# EAGLE schematic power (EAGLE 8.6.0)

## Sheet 1 of 2
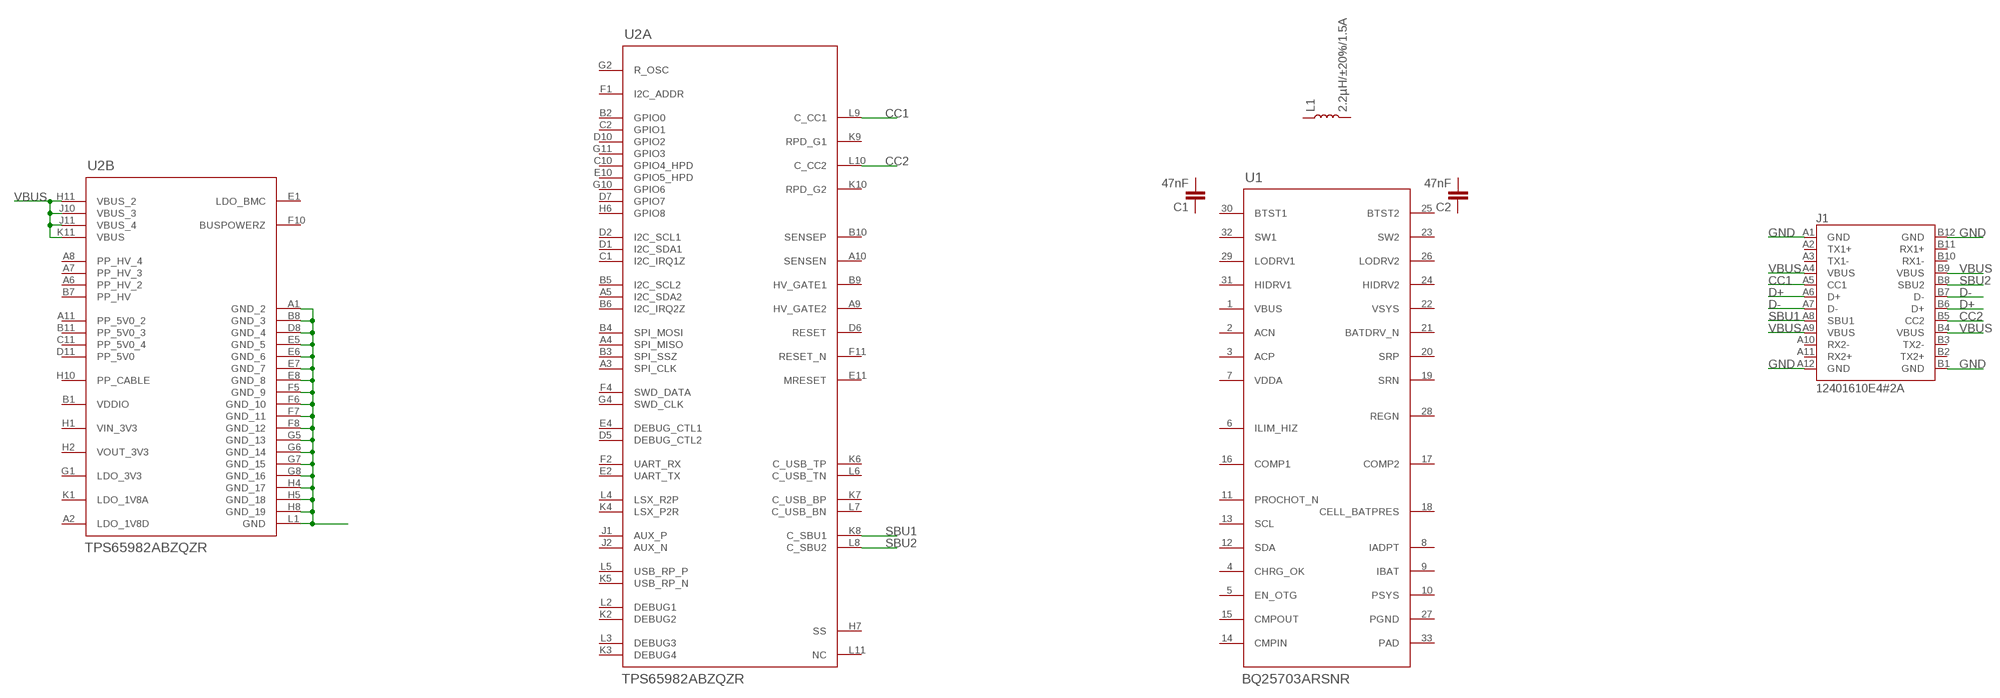
[diagram p0: schematic, sheet 1]

### Parts
C1  47nF  47NF-0603-25V-5%  [0603]
C2  47nF  47NF-0603-25V-5%  [0603]
J1  12401610E4#2A  [AMPHENOL_12401610E4#2A]
L1  2.2µH/±20%/1.5A  INDUCTOR-VLF4012AT-2.2UH  [INDUCTOR_2.2UH]
U1  BQ25703ARSNR  [RSN0032B]
U2  TPS65982ABZQZR  [ZQZ0096A]

### Nets
CC1: J1.A5(CC1) U2.L9(A:C_CC1)
CC2: J1.B5(CC2) U2.L10(A:C_CC2)
D+: J1.A6(D+) J1.B6(D+) ; also sheet 2
D-: J1.A7(D-) J1.B7(D-) ; also sheet 2
GND: J1.A1(GND) J1.A12(GND) J1.B1(GND) J1.B12(GND) U2.A1(B:GND_2) U2.B8(B:GND_3) U2.D8(B:GND_4) U2.E5(B:GND_5) U2.E6(B:GND_6) U2.E7(B:GND_7) U2.E8(B:GND_8) U2.F5(B:GND_9) U2.F6(B:GND_10) U2.F7(B:GND_11) U2.F8(B:GND_12) U2.G5(B:GND_13) U2.G6(B:GND_14) U2.G7(B:GND_15) U2.G8(B:GND_16) U2.H4(B:GND_17) U2.H5(B:GND_18) U2.H8(B:GND_19) U2.L1(B:GND) ; also sheet 2
SBU1: J1.A8(SBU1) U2.K8(A:C_SBU1)
SBU2: J1.B8(SBU2) U2.L8(A:C_SBU2)
VBUS: J1.A4(VBUS) J1.A9(VBUS) J1.B4(VBUS) J1.B9(VBUS) U2.H11(B:VBUS_2) U2.J10(B:VBUS_3) U2.J11(B:VBUS_4) U2.K11(B:VBUS) ; also sheet 2
Unconnected: C1.1 C1.2 C2.1 C2.2 J1.A2(TX1+) J1.A3(TX1-) J1.A10(RX2-) J1.A11(RX2+) J1.B2(TX2+) J1.B3(TX2-) J1.B10(RX1-) J1.B11(RX1+) L1.P$1 L1.P$2 U1.2(ACN) U1.3(ACP) U1.4(CHRG_OK) U1.5(EN_OTG) U1.6(ILIM_HIZ) U1.8(IADPT) U1.9(IBAT) U1.10(PSYS) U1.11(PROCHOT_N) U1.12(SDA) U1.13(SCL) U1.14(CMPIN) U1.15(CMPOUT) U1.16(COMP1) U1.17(COMP2) U1.18(CELL_BATPRES) U1.19(SRN) U1.20(SRP) U1.21(BATDRV_N) U1.24(HIDRV2) U1.26(LODRV2) U1.29(LODRV1) U1.31(HIDRV1) U2.A3(A:SPI_CLK) U2.A4(A:SPI_MISO) U2.A5(A:I2C_SDA2) U2.A9(A:HV_GATE2) U2.A10(A:SENSEN) U2.B2(A:GPIO0) U2.B3(A:SPI_SSZ) U2.B4(A:SPI_MOSI) U2.B5(A:I2C_SCL2) U2.B6(A:I2C_IRQ2Z) U2.B9(A:HV_GATE1) U2.B10(A:SENSEP) U2.C1(A:I2C_IRQ1Z) U2.C2(A:GPIO1) U2.C10(A:GPIO4_HPD) U2.D1(A:I2C_SDA1) U2.D2(A:I2C_SCL1) U2.D5(A:DEBUG_CTL2) U2.D6(A:RESET) U2.D7(A:GPIO7) U2.D10(A:GPIO2) U2.E2(A:UART_TX) U2.E4(A:DEBUG_CTL1) U2.E10(A:GPIO5_HPD) U2.E11(A:MRESET) U2.F1(A:I2C_ADDR) U2.F2(A:UART_RX) U2.F4(A:SWD_DATA) U2.F11(A:RESET_N) U2.G2(A:R_OSC) U2.G4(A:SWD_CLK) U2.G10(A:GPIO6) U2.G11(A:GPIO3) U2.H6(A:GPIO8) U2.H7(A:SS) U2.J1(A:AUX_P) U2.J2(A:AUX_N) U2.K2(A:DEBUG2) U2.K3(A:DEBUG4) U2.K4(A:LSX_P2R) U2.K5(A:USB_RP_N) U2.K6(A:C_USB_TP) U2.K7(A:C_USB_BP) U2.K9(A:RPD_G1) U2.K10(A:RPD_G2) U2.L2(A:DEBUG1) U2.L3(A:DEBUG3) U2.L4(A:LSX_R2P) U2.L5(A:USB_RP_P) U2.L6(A:C_USB_TN) U2.L7(A:C_USB_BN) U2.L11(A:NC)

## Sheet 2 of 2
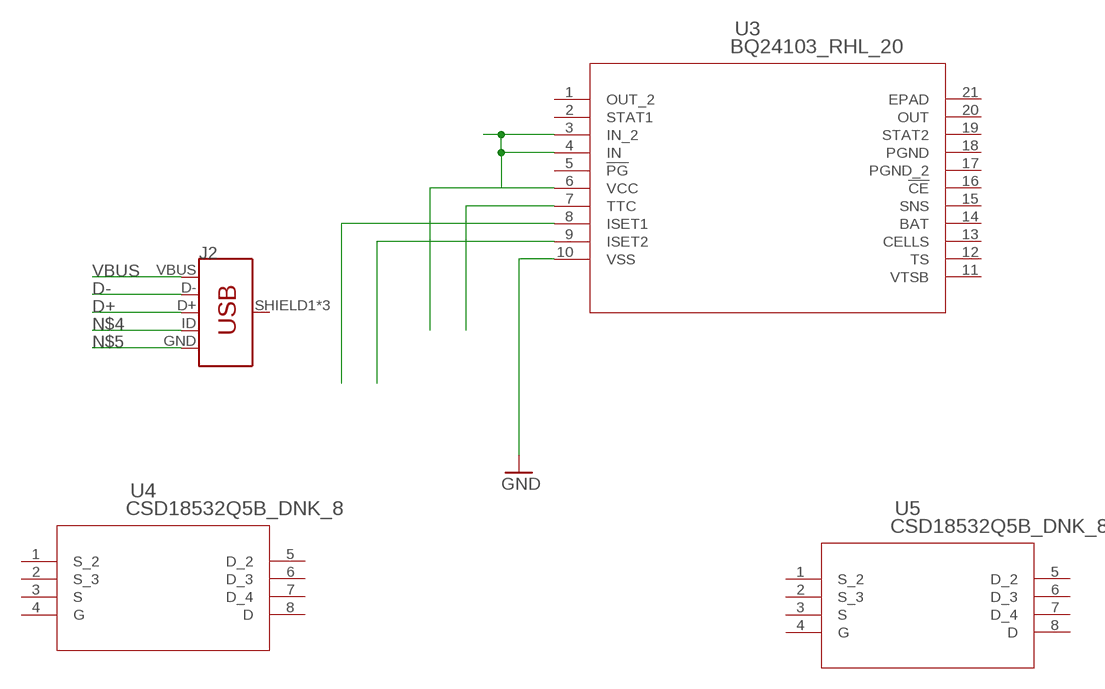
[diagram p1: schematic, sheet 2]

### Parts
J2  USB_MICRO-B_FEMALE-SMT  [USB-B-MICRO-SMD]
U3  BQ24103_RHL_20  [RHL20_2P05X3P05]
U4  CSD18532Q5B_DNK_8  [DNK8]
U5  CSD18532Q5B_DNK_8  [DNK8]

### Nets
D+: J2.D+ ; also sheet 1
D-: J2.D- ; also sheet 1
GND: U3.10(VSS) ; also sheet 1
N$4: J2.ID
N$5: J2.GND
N$6: U3.3(IN_2) U3.4(IN) U3.6(VCC)
N$7: U3.9(ISET2)
N$9: U3.7(TTC)
N$10: U3.8(ISET1)
VBUS: J2.VBUS ; also sheet 1
Unconnected: J2.SHIELD1(SHIELD) J2.SHIELD2(SHIELD) J2.SHIELD3(SHIELD) U3.1(OUT_2) U3.2(STAT1) U3.5(!PG) U3.11(VTSB) U3.12(TS) U3.13(CELLS) U3.14(BAT) U3.15(SNS) U3.16(!CE) U3.19(STAT2) U3.20(OUT) U3.21(EPAD) U4.1(S_2) U4.2(S_3) U4.3(S) U4.4(G) U4.5(D_2) U4.6(D_3) U4.7(D_4) U4.8(D) U5.1(S_2) U5.2(S_3) U5.3(S) U5.4(G) U5.5(D_2) U5.6(D_3) U5.7(D_4) U5.8(D)

## Power pins joined to a net without a drawn wire
BTST1: U1.30(BTST1)
BTST2: U1.25(BTST2)
BUSPOWERZ: U2.F10(B:BUSPOWERZ)
LDO_1V8A: U2.K1(B:LDO_1V8A)
LDO_1V8D: U2.A2(B:LDO_1V8D)
LDO_3V3: U2.G1(B:LDO_3V3)
LDO_BMC: U2.E1(B:LDO_BMC)
PAD: U1.33(PAD)
PGND: U1.27(PGND) U3.18(PGND)
PGND_2: U3.17(PGND_2)
PP_5V0: U2.D11(B:PP_5V0)
PP_5V0_2: U2.A11(B:PP_5V0_2)
PP_5V0_3: U2.B11(B:PP_5V0_3)
PP_5V0_4: U2.C11(B:PP_5V0_4)
PP_CABLE: U2.H10(B:PP_CABLE)
PP_HV: U2.B7(B:PP_HV)
PP_HV_2: U2.A6(B:PP_HV_2)
PP_HV_3: U2.A7(B:PP_HV_3)
PP_HV_4: U2.A8(B:PP_HV_4)
REGN: U1.28(REGN)
SW1: U1.32(SW1)
SW2: U1.23(SW2)
VBUS: U1.1(VBUS)
VDDA: U1.7(VDDA)
VDDIO: U2.B1(B:VDDIO)
VIN_3V3: U2.H1(B:VIN_3V3)
VOUT_3V3: U2.H2(B:VOUT_3V3)
VSYS: U1.22(VSYS)

## Library data of the parts
C1 C2 = SparkFun-Capacitors:47NF: 47nF ceramic capacitors A capacitor is a passive two-terminal electrical component used to store electrical energy temporarily in an electric field.; PROD_ID: CAP-08605
J1 = power_module:12401610E4#2A: Usb Type-c, Ra Rcpt, Pcb Mount,; DESCRIPTION: USB TYPE-C, RA RCPT, PCB MOUNT,; DIGI-KEY_PART_NUMBER: 12401610E4#2ACT-ND; DIGI-KEY_PURCHASE_URL: https://www.digikey.com/product-detail/en/amphenol-commercial-products/12401610E4-2A/12401610E4-2ACT-ND/5775520?WT.z_cid=ref_snapeda&utm_source=snapeda&utm_medium=aggregator&utm_campaign=buynow; MF: Amphenol; MP: 12401610E4#2A; PACKAGE: None
J2 = power_module:USB_MICRO-B: USB Type Micro-B Connector Male/female and PTH/SMT variants SparkFun Products: SparkFun microB USB Breakout <https://www.sparkfun.com/products/12035> SparkFun USB microB Plug Breakout <https://www.sparkfun.com/products/10031> SparkFun ESP8266 Thing <https://www.sparkfun.com/products/13231>; PROD_ID: CONN-11752
L1 = SparkFun-Coils:INDUCTOR: Inductors Resist changes in electrical current. Basically a coil of wire. SparkFun Products: SparkFun Load Cell Amplifier - HX711 <https://www.sparkfun.com/products/13879> IOIO-OTG - V2.2 <https://www.sparkfun.com/products/13613>; PROD_ID: NDUC-09513
U1 = power_module:BQ25703ARSNR
U2 = power_module:TPS65982ABZQZR
U3 = power_module:BQ24103_RHL_20
U4 U5 = power_module:CSD18532Q5B_DNK_8; MANUFACTURER_PART_NUMBER: csd18532q5b_dnk_8; VENDOR: TEXAS INSTRUMENTS